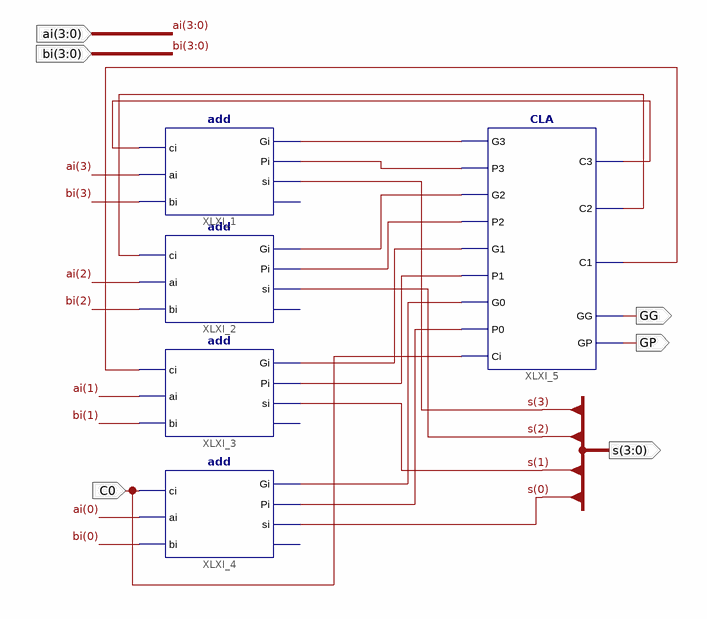
[diagram p0: schematic sheet 1]
// Xilinx ISE schematic ACLA4.sch (kintex7) as structural Verilog: 5 symbols, 6 ports
module ACLA4 (
  input  C0,
  input  [3:0] ai,
  input  [3:0] bi,
  output [3:0] s,
  output GG,
  output GP
);

  wire XLXN_1, XLXN_2, XLXN_3, XLXN_4, XLXN_5, XLXN_6, XLXN_7, XLXN_9, XLXN_10, XLXN_11, XLXN_12;

  add XLXI_1 (.ci(XLXN_1), .ai(ai[3]), .bi(bi[3]), .si(s[3]), .Gi(XLXN_2), .Pi(XLXN_3));  // open: co
  add XLXI_2 (.ci(XLXN_11), .ai(ai[2]), .bi(bi[2]), .si(s[2]), .Gi(XLXN_4), .Pi(XLXN_5));  // open: co
  add XLXI_3 (.ci(XLXN_12), .ai(ai[1]), .bi(bi[1]), .si(s[1]), .Gi(XLXN_6), .Pi(XLXN_7));  // open: co
  add XLXI_4 (.ci(C0), .ai(ai[0]), .bi(bi[0]), .si(s[0]), .Gi(XLXN_9), .Pi(XLXN_10));  // open: co
  CLA XLXI_5 (
    .G3(XLXN_2), .P3(XLXN_3), .G2(XLXN_4), .P0(XLXN_10), .Ci(C0), .G0(XLXN_9), .P2(XLXN_5), .G1(XLXN_6),
    .P1(XLXN_7), .C3(XLXN_1), .C2(XLXN_11), .C1(XLXN_12), .GP(GP), .GG(GG));
endmodule
